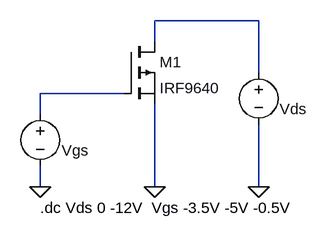
[diagram p0: schematic output-1-2.asc]
output-1-2.asc, the LTspice schematic file:
Version 4
SHEET 1 1292 680
WIRE -560 -176 -720 -176
WIRE -720 -144 -720 -176
WIRE -560 -96 -560 -176
WIRE -768 -64 -896 -64
WIRE -896 -32 -896 -64
WIRE -896 80 -896 48
WIRE -720 80 -720 -48
WIRE -560 80 -560 -16
FLAG -560 80 0
FLAG -896 80 0
FLAG -720 80 0
SYMBOL voltage -560 -112 R0
WINDOW 123 0 0 Left 2
WINDOW 39 37 60 Left 2
WINDOW 0 32 72 Left 2
WINDOW 3 37 60 Left 2
SYMATTR InstName Vds
SYMATTR Value ""
SYMBOL voltage -896 -48 R0
WINDOW 123 0 0 Left 2
WINDOW 39 40 53 Left 2
WINDOW 3 40 69 Left 2
WINDOW 0 33 72 Left 2
SYMATTR Value ""
SYMATTR InstName Vgs
SYMBOL pmos -768 -144 R0
SYMATTR InstName M1
SYMATTR Value IRF9640
TEXT -896 112 Left 2 !.dc Vds 0 -12V  Vgs -3.5V -5V -0.5V

The netlist it stands for:
* output-1-2.asc
Vds N001 0
Vgs N002 0
M1 N001 N002 0 0 IRF9640
.model NMOS NMOS
.model PMOS PMOS
.lib standard.mos
.dc Vds 0 -12V  Vgs -3.5V -5V -0.5V
.backanno
.end